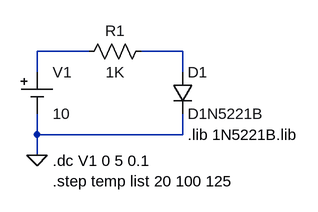
[diagram p0: schematic simulacionTemperatura.asc]
simulacionTemperatura.asc, the LTspice schematic file:
Version 4.1
SHEET 1 880 680
WIRE 128 96 48 96
WIRE 272 96 208 96
WIRE 48 128 48 96
WIRE 272 128 272 96
WIRE 48 224 48 192
WIRE 272 224 272 192
WIRE 272 224 48 224
WIRE 48 256 48 224
FLAG 48 256 0
SYMBOL res 224 80 R90
WINDOW 0 0 56 VBottom 2
WINDOW 3 32 56 VTop 2
SYMATTR InstName R1
SYMATTR Value 1K
SYMBOL Misc\\cell 48 128 R0
WINDOW 123 0 0 Left 0
WINDOW 39 0 0 Left 0
SYMATTR InstName V1
SYMATTR Value 10
SYMBOL diode 256 128 R0
SYMATTR InstName D1
SYMATTR Value D1N5221B
TEXT 72 264 Left 2 !.dc V1 0 5 0.1
TEXT 72 296 Left 2 !.step temp list 20 100 125
TEXT 280 224 Left 2 !.lib 1N5221B.lib

The netlist it stands for:
* simulacionTemperatura.asc
R1 N002 N001 1K
V1 N001 0 10
D1 N002 0 D1N5221B
.model D D
.lib standard.dio
.dc V1 0 5 0.1
.step temp list 20 100 125
.lib 1N5221B.lib
.backanno
.end